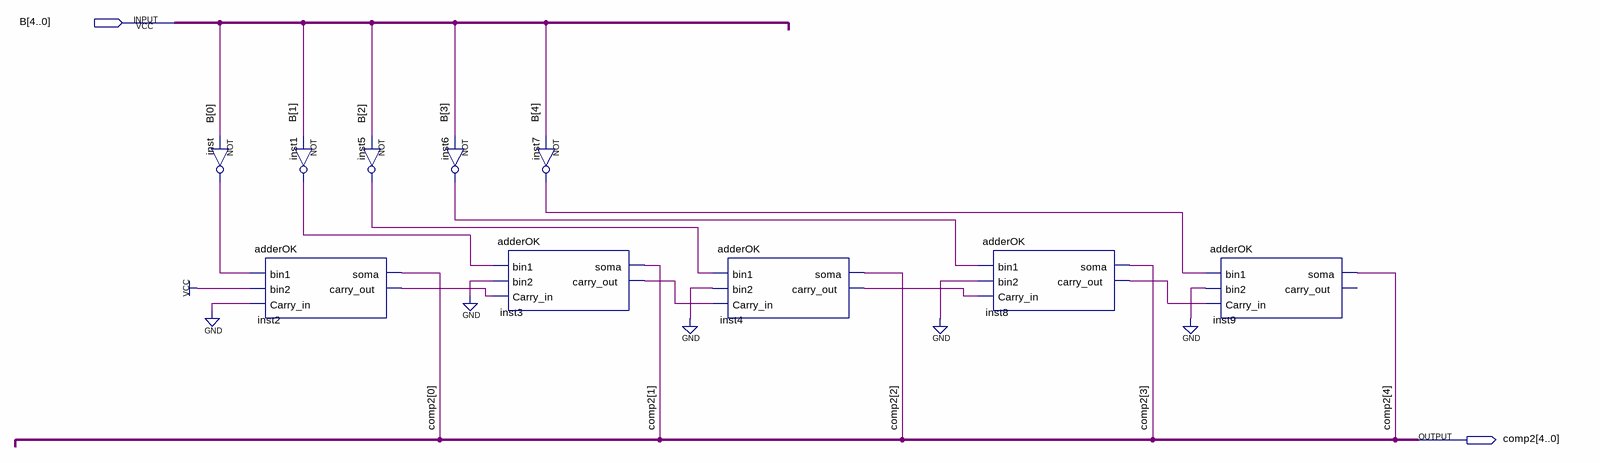
[diagram p0: schematic sheet]
// Quartus schematic complemento2OK.bdf as structural Verilog: 10 symbols, 2 pins
module complemento2OK (
  input  [4:0] B,
  output [4:0] comp2
);

  wire inst1_out, inst2_carry_out, inst3_carry_out, inst4_carry_out, inst5_out, inst6_out, inst7_out,
       inst8_carry_out, inst_out;

  not inst (inst_out, B[0]);
  adderOK inst2 (.bin1(inst_out), .bin2(1'b1), .Carry_in(1'b0), .soma(comp2[0]), .carry_out(inst2_carry_out));
  not inst1 (inst1_out, B[1]);
  not inst5 (inst5_out, B[2]);
  not inst6 (inst6_out, B[3]);
  adderOK inst3 (
    .bin1(inst1_out), .bin2(1'b0), .Carry_in(inst2_carry_out), .soma(comp2[1]), .carry_out(inst3_carry_out));
  not inst7 (inst7_out, B[4]);
  adderOK inst4 (
    .bin1(inst5_out), .bin2(1'b0), .Carry_in(inst3_carry_out), .soma(comp2[2]), .carry_out(inst4_carry_out));
  adderOK inst8 (
    .bin1(inst6_out), .bin2(1'b0), .Carry_in(inst4_carry_out), .soma(comp2[3]), .carry_out(inst8_carry_out));
  adderOK inst9 (.bin1(inst7_out), .bin2(1'b0), .Carry_in(inst8_carry_out), .soma(comp2[4]));  // open: carry_out
endmodule
